# EAGLE design remote (EAGLE 6.4)
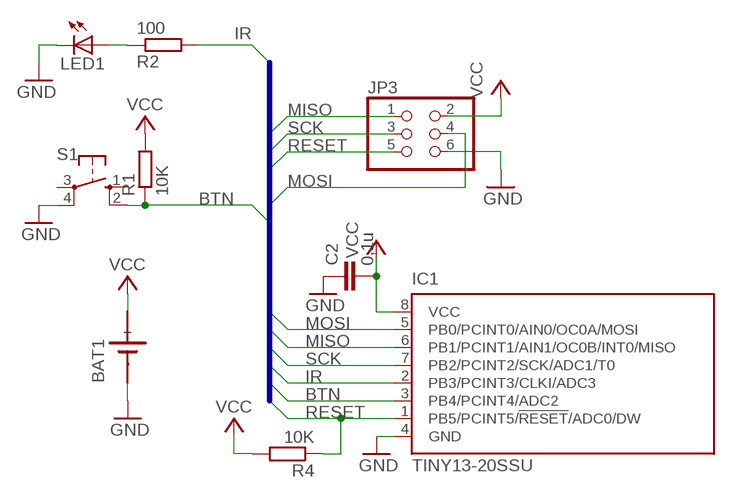
[diagram p0: schematic, sheet 1]

## Parts
BAT1  SN2032  [SN2032]
C2  0,1u  C-EUC1206  [C1206]
IC1  TINY13-20SSU  [8S1]
JP3  PINHD-2X3_2.54  [2X03]
LED1  LED3MM  [LED3MM]
R1  10K  R-EU_R1206  [R1206]
R2  100  R-EU_R1206  [R1206]
R4  10K  R-EU_R1206  [R1206]
S1  10-XX  [B3F-10XX]

## Nets
BTN: IC1.3(PB4/PCINT4/ADC2) R1.1 S1.2(S1)
GND: BAT1.- C2.1 IC1.4(GND) JP3.6 LED1.K(C) S1.4(P1)
IR: IC1.2(PB3/PCINT3/CLKI/ADC3) R2.2
MISO: IC1.6(PB1/PCINT1/AIN1/OC0B/INT0/MISO) JP3.1
MOSI: IC1.5(PB0/PCINT0/AIN0/OC0A/MOSI) JP3.4
N$1: LED1.A R2.1
RESET: IC1.1(PB5/PCINT5/!RESET!/ADC0/DW) JP3.5 R4.1
SCK: IC1.7(PB2/PCINT2/SCK/ADC1/T0) JP3.3
VCC: BAT1.+ C2.2 IC1.8(VCC) JP3.2 R1.2 R4.2
Unconnected: S1.1(S) S1.3(P)

## Buses
IR,MOSI,MISO,SCK,RESET,BTN

## Library data of the parts
BAT1 = sn2032:SN2032: LI BATTERY
C2 = rcl:C-EU: CAPACITOR, European symbol
IC1 = atmel:TINY13: 8-bit AVR Microcontroller with 1K Bytes In-System Programmable Flash Source: http://www.atmel.com/dyn/resources/prod_documents/2535S.pdf; MPN: ATTINY13-20SSU; OC_FARNELL: 1455133; OC_NEWARK: 58M3771
JP3 = pinhead-1:PINHD-2X3: PIN HEADER
LED1 = adafruit:LED: LED OSRAM: - CHIPLED LG R971, LG N971, LY N971, LG Q971, LY Q971, LO R971, LY R971 LH N974, LH R974 LS Q976, LO Q976, LY Q976 LO Q996 - Hyper CHIPLED LW Q18S LB Q993, LB Q99A, LB R99A - SideLED LS A670, LO A670, LY A670, LG A670, LP A670 LB A673, LV A673, LT A673, LW A673 LH A674 LY A675 LS A676, LA A676, LO A676, LY A676, LW A676 LS A679, LY A679, LG A679 - Hyper Micro SIDELED® LS Y876, LA Y876, LO Y876, LY Y876 LT Y87S - SmartLED LW L88C, LW L88S LB L89C, LB L89S, LG L890 LS L89K, LO L89K, LY L89K LS L896, LA L896, LO L896, LY L896 - TOPLED LS T670, LO T670, LY T670, LG T670, LP T670 LSG T670, LSP T670, LSY T670, LOP T670, LYG T670 LG T671, LOG T671, LSG T671 LB T673, LV T673, LT T673, LW T673 LH T674 LS T676, LA T676, LO T676, LY T676, LB T676, LH T676, LSB T676, LW T676 LB T67C, LV T67C, LT T67C, LS T67K, LO T67K, LY T67K, LW E67C LS E67B, LA E67B, LO E67B, LY E67B, LB E67C, LV E67C, LT E67C LW T67C LS T679, LY T679, LG T679 LS T770, LO T770, LY T770, LG T770, LP T770 LB T773, LV T773, LT T773, LW T773 LH T774 LS E675, LA E675, LY E675, LS T675 LS T776, LA T776, LO T776, LY T776, LB T776 LHGB T686 LT T68C, LB T68C - Hyper Mini TOPLED® LB M676 - Mini TOPLED Santana® LG M470 LS M47K, LO M47K, LY M47K Source: http://www.osram.convergy.de/
R1 R2 R4 = resistor:R-EU_: RESISTOR, European symbol
S1 = switch-omron:10-XX: OMRON SWITCH; MPN: B3F-1000; OC_FARNELL: 176432; OC_NEWARK: 36M3542

## Net classes
0 default: clearance 0.355 mm

## Board
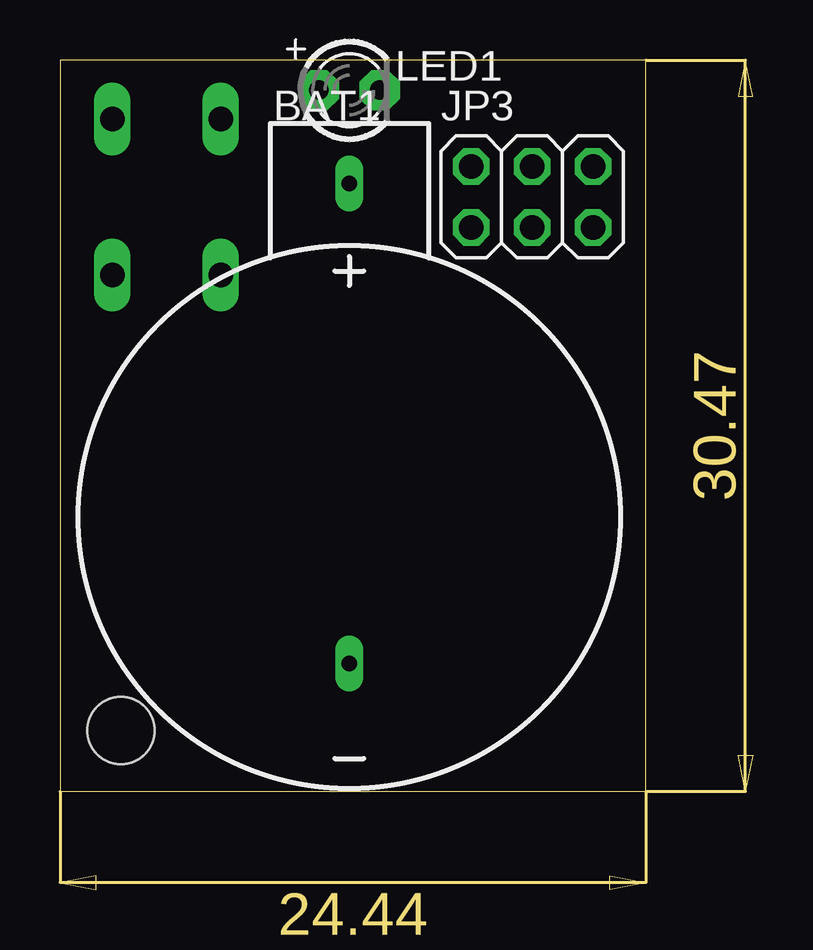
[diagram p1: board, top side]
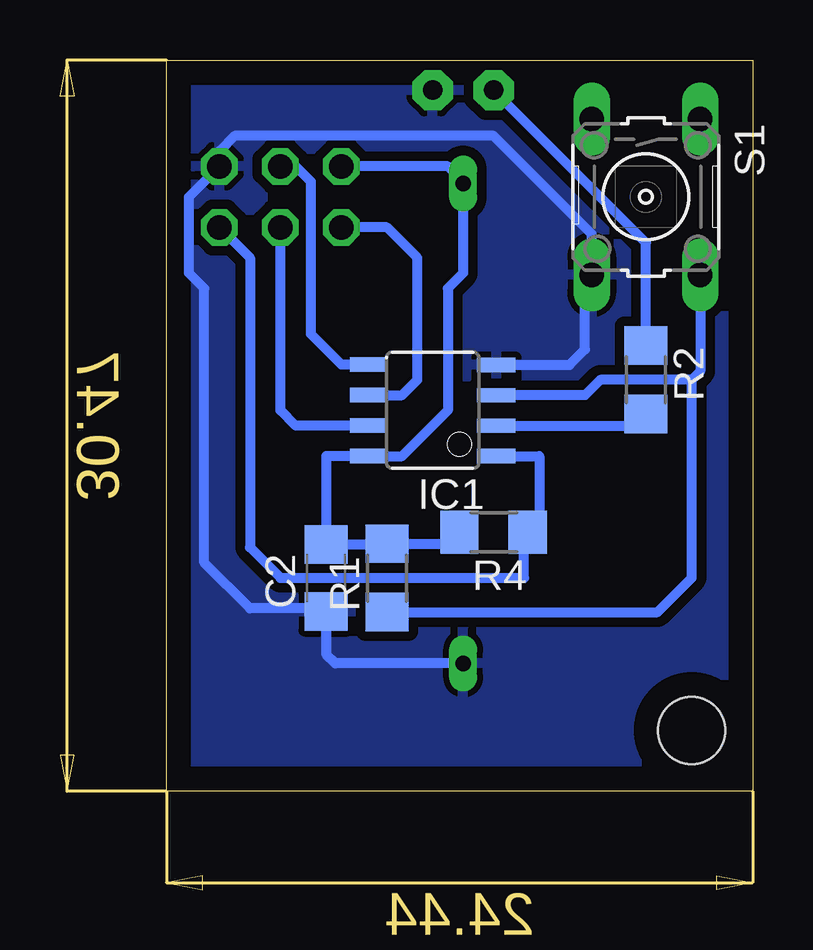
[diagram p2: board, bottom side, seen from below]

Size 24.44 x 30.47 mm. Coordinates in mm from the lower left corner, seen from the top.
Outline: 0,0 24.44,0 24.44,30.47 0,30.47 0,0
Copper layers (1*16): Top 0.035mm / dielectric 1.5mm / Bottom 0.035mm
Design rules "default": minimum track width 10mil, minimum drill 24mil, track to track 8mil, track to pad 8mil, pad to pad 8mil, via to via 8mil, smd to smd 8mil, copper to edge 40mil, drill to drill 8mil, minimum pad ring 10mil, minimum via ring 8mil, stop-mask expansion 4mil, vias tented up to drill 0mil, thermal gap 10mil
Holes 2.8 mm at 2.54,2.54

### Footprints (pad centres in the part's own frame; a part is rotated, then mirrored left to right if it is on the bottom)
SN2032 = drill 0.65 long: + 0,13.9; - 0,-6.1
C1206 = smd 1.6 x 1.8: 1 -1.4,0; 2 1.4,0
8S1 = smd 0.6 x 1.6: 1 -1.905,-2.654; 2 -0.645,-2.654; 3 0.625,-2.654; 4 1.895,-2.654; 5 1.905,2.654; 6 0.635,2.654; 7 -0.635,2.654; 8 -1.905,2.654
2X03 = drill 1.016 octagon: 1 -2.54,-1.27; 2 -2.54,1.27; 3 0,-1.27; 4 0,1.27; 5 2.54,-1.27; 6 2.54,1.27
LED3MM = drill 0.813 pad 1.676 octagon: A -1.27,0; K 1.27,0
R1206 = smd 1.6 x 1.803: 1 -1.422,0; 2 1.422,0
B3F-10XX = drill 1.016 long: 1 -3.251,2.261; 2 3.251,2.261; 3 -3.251,-2.261; 4 3.251,-2.261

### Placement (x,y rotation side)
BAT1  12.06,11.43 0 top
C2  17.78,8.89 90 bottom
IC1  13.33,15.88 90 bottom
JP3  19.69,24.77 0 top
LED1  12.06,29.21 0 top
R1  15.24,8.89 90 bottom
R2  4.45,17.14 270 bottom
R4  10.79,10.79 180 bottom
S1  4.45,24.77 270 bottom

### Tracks (layer width: path | path; a pad name or v marks a point on that pad's centre or on a via)
BTN
  Bottom 0.406: S1.2 2.18,17.5 2.54,17.14 | 2.54,17.14 6.35,17.14 6.98,16.51 10.67,16.51 IC1.3 | R1.1 3.96,7.47 2.54,8.89 2.54,17.14
GND
  Bottom 0.406: BAT1.- 17.4,5.33 17.78,5.71 C2.1 17.78,7.62 20.96,7.62 22.86,9.53 22.86,20.95 23.5,21.59 23.5,24.77 JP3.6 22.23,26.67 21.59,27.3 10.79,27.3 6.71,23.22 S1.4 6.98,21.23 6.98,18.41 7.63,17.77 IC1.4
  pour Bottom (isolate 0.406): 0,30.48 0,0 24.77,0 24.77,30.48
IR
  Bottom 0.406: IC1.2 4.94,15.23 R2.2
MISO
  Bottom 0.406: IC1.6 14.61,16.51 13.97,17.14 13.97,22.23 15.24,23.5 JP3.1
MOSI
  Bottom 0.406: IC1.5 17.15,17.78 18.42,19.05 18.42,25.4 19.05,26.04 JP3.4
N$1
  Bottom 0.406: R2.1 4.45,22.86 LED1.A
RESET
  Bottom 0.406: IC1.1 8.89,13.97 8.89,10.79 R4.1 9.53,10.64 9.53,8.89 19.69,8.89 20.96,10.16 20.96,22.23 JP3.5
SCK
  Bottom 0.406: IC1.7 19.05,15.24 19.69,15.88 JP3.3
VCC
  Bottom 0.406: JP3.2 12.7,26.04 12.06,25.4 BAT1.+ 12.06,21.59 12.7,20.95 12.7,15.88 14.61,13.97 IC1.8 17.78,13.97 C2.2 15.26,10.29 R1.2 12.7,10.31 R4.2